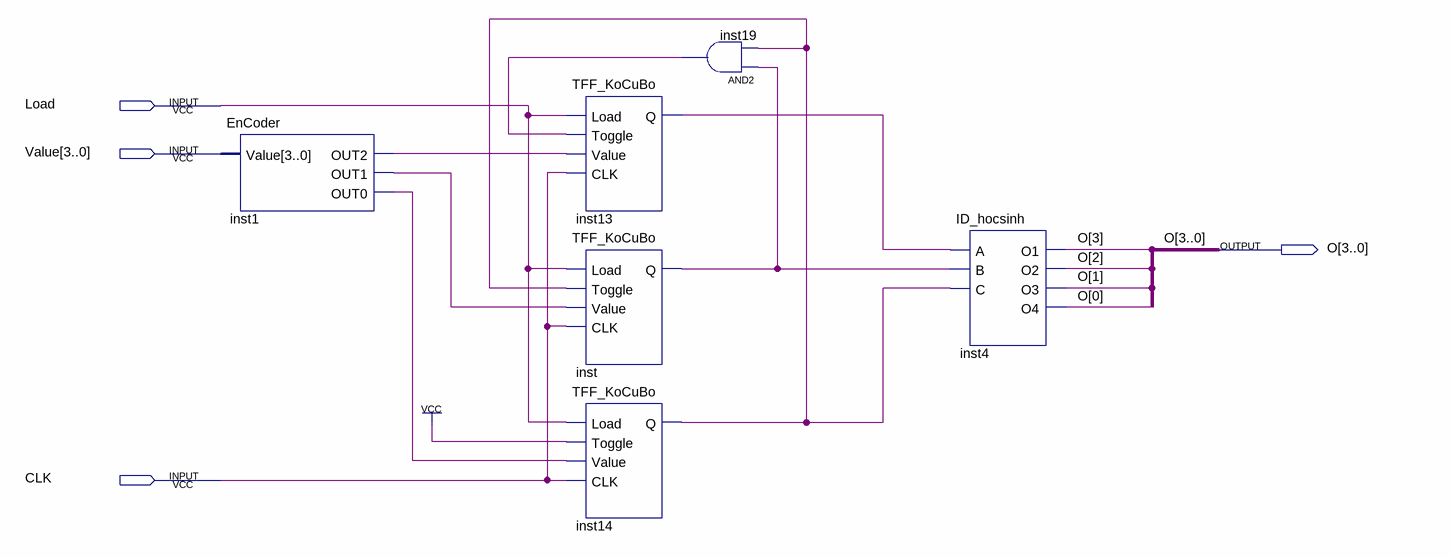
[diagram p0: schematic sheet]
// Quartus schematic bat_dong_bo_1234.bdf as structural Verilog: 6 symbols, 4 pins
module bat_dong_bo_1234 (
  input  Load,
  input  [3:0] Value,
  input  CLK,
  output [3:0] O
);

  wire inst1_out0, inst1_out1, inst1_out2, inst13_q, inst14_q, inst19_out, inst_q;

  EnCoder inst1 (.Value(Value), .OUT2(inst1_out2), .OUT1(inst1_out1), .OUT0(inst1_out0));
  TFF_KoCuBo inst13 (.Load(Load), .Toggle(inst19_out), .Value(inst1_out2), .CLK(CLK), .Q(inst13_q));
  TFF_KoCuBo inst (.Load(Load), .Toggle(inst14_q), .Value(inst1_out1), .CLK(CLK), .Q(inst_q));
  TFF_KoCuBo inst14 (.Load(Load), .Toggle(1'b1), .Value(inst1_out0), .CLK(CLK), .Q(inst14_q));
  and inst19 (inst19_out, inst_q, inst14_q);
  ID_hocsinh inst4 (.A(inst13_q), .B(inst_q), .C(inst14_q), .O1(O[3]), .O2(O[2]), .O3(O[1]), .O4(O[0]));
endmodule
